# EAGLE design reciever_pcb (EAGLE 7.3.0)
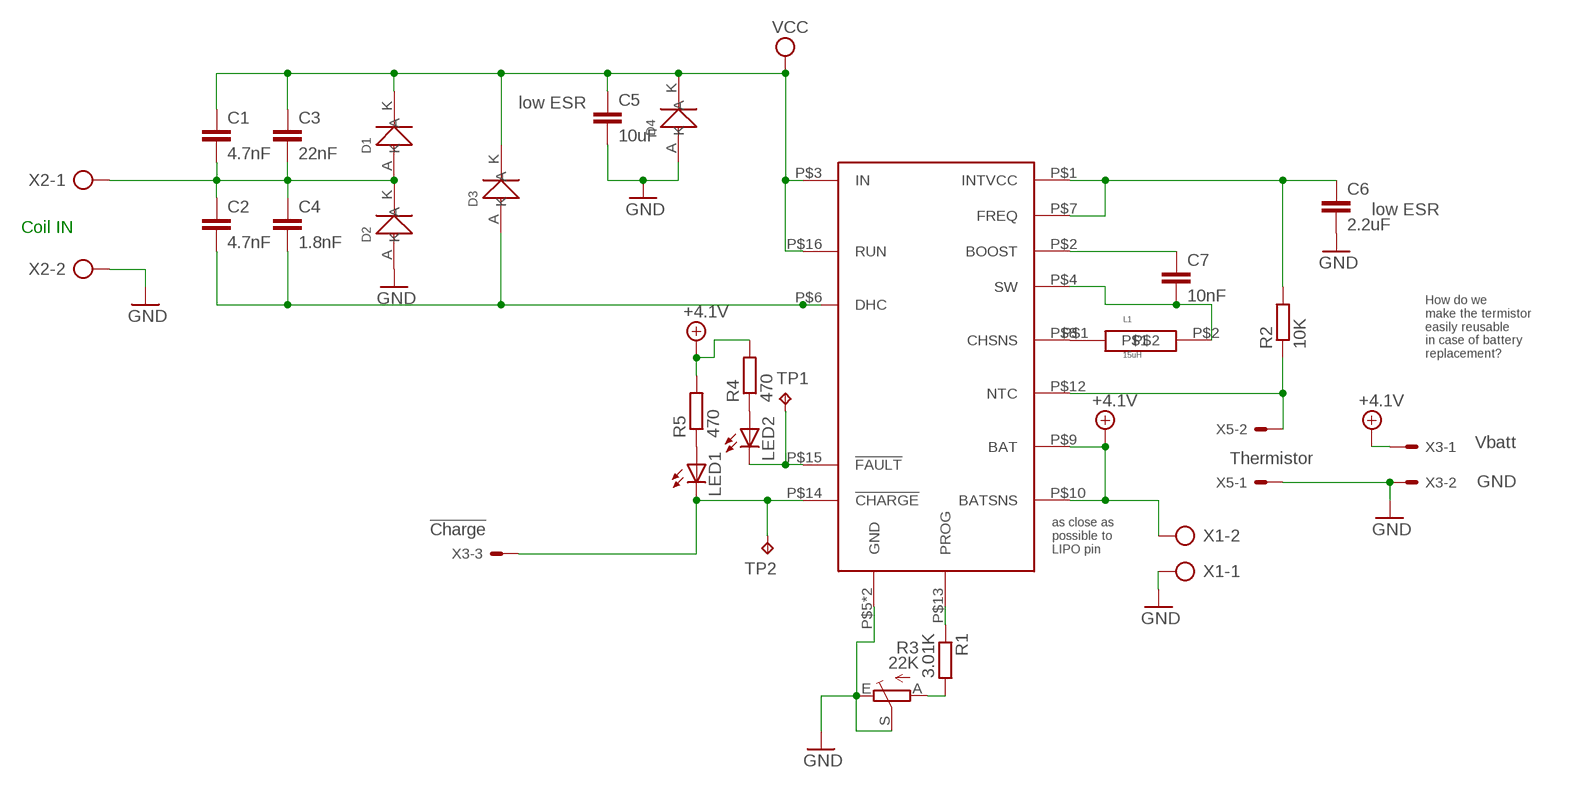
[diagram p0: schematic, sheet 1]

## Parts
C1  4.7nF  C-EUC0805  [C0805]
C2  4.7nF  C-EUC0805  [C0805]
C3  22nF  C-EUC0805  [C0805]
C4  1.8nF  C-EUC0805  [C0805]
C5  10uF  C-EUC0805  [C0805]
C6  2.2uF  C-EUC0805  [C0805]
C7  10nF  C-EUC0805  [C0805]
D1  DFLS240L  [POWERDI123]
D2  DFLS240L  [POWERDI123]
D3  DFLS240L  [POWERDI123]
D4  39VZ  DFLS240L  [POWERDI123]
L1  15uH  D62LCB  [D62LCB]
LED1  LEDCHIP-LED0805  [CHIP-LED0805]
LED2  LEDCHIP-LED0805  [CHIP-LED0805]
R1  3.01K  R-EU_R0805  [R0805]
R2  10K  R-EU_R0805  [R0805]
R3  22K  TRIM_EU-S63S  [S63S]
R4  470  R-EU_R0805  [R0805]
R5  470  R-EU_R0805  [R0805]
TP1  TPTP19R  [TP19R]
TP2  TPTP19R  [TP19R]
U$1  LT4120  [QFN16]
X1  AK500/2  [AK500/2]
X2  AK500/2  [AK500/2]
X3  KK-156-3  [KK-156-3]
X5  KK-156-2  [KK-156-2]

## Nets
+4.1V: R4.2 R5.2 U$1.P$9(BAT) U$1.P$10(BATSNS) X1.2 X3.1
GND: C5.2 C6.2 D2.A D4.A R3.E R3.S U$1.P$5(GND) U$1.P$17(GND) X1.1 X2.2 X3.2 X5.1
N$1: C1.2 C2.1 C3.2 C4.1 D1.A D2.K X2.1
N$2: C2.2 C4.2 D3.A U$1.P$6(DHC)
N$3: C6.1 R2.2 U$1.P$1(INTVCC) U$1.P$7(FREQ)
N$4: C7.1 U$1.P$2(BOOST)
N$5: C7.2 L1.P$2 U$1.P$4(SW)
N$6: L1.P$1 U$1.P$8(CHSNS)
N$7: R1.1 U$1.P$13(PROG)
N$8: R2.1 U$1.P$12(NTC) X5.2
N$9: LED1.C TP2.TP U$1.P$14(!CHARGE) X3.3
N$10: LED2.A R4.1
N$11: LED1.A R5.1
N$12: R1.2 R3.A
N$13: LED2.C TP1.TP U$1.P$15(!FAULT)
VCC: C1.1 C3.1 C5.1 D1.K D3.K D4.K U$1.P$3(IN) U$1.P$16(RUN)

## Notes on the sheet
- low ESR
- low ESR
- Coil IN
- How do we
  make the termistor
  easily reusable
  in case of battery
  replacement?
- Vbatt
- Thermistor
- GND
- !Charge
- as close as 
  possible to
  LIPO pin

## Library data of the parts
C1-C7 = rcl:C-EU: CAPACITOR, European symbol
D1-D4 = custom parts:DFLS240L
L1 = custom parts:D62LCB
LED1 LED2 = led:LED: LED OSRAM: - CHIPLED LG R971, LG N971, LY N971, LG Q971, LY Q971, LO R971, LY R971 LH N974, LH R974 LS Q976, LO Q976, LY Q976 LO Q996 - Hyper CHIPLED LW Q18S LB Q993, LB Q99A, LB R99A - SideLED LS A670, LO A670, LY A670, LG A670, LP A670 LB A673, LV A673, LT A673, LW A673 LH A674 LY A675 LS A676, LA A676, LO A676, LY A676, LW A676 LS A679, LY A679, LG A679 - Hyper Micro SIDELED® LS Y876, LA Y876, LO Y876, LY Y876 LT Y87S - SmartLED LW L88C, LW L88S LB L89C, LB L89S, LG L890 LS L89K, LO L89K, LY L89K LS L896, LA L896, LO L896, LY L896 - TOPLED LS T670, LO T670, LY T670, LG T670, LP T670 LSG T670, LSP T670, LSY T670, LOP T670, LYG T670 LG T671, LOG T671, LSG T671 LB T673, LV T673, LT T673, LW T673 LH T674 LS T676, LA T676, LO T676, LY T676, LB T676, LH T676, LSB T676, LW T676 LB T67C, LV T67C, LT T67C, LS T67K, LO T67K, LY T67K, LW E67C LS E67B, LA E67B, LO E67B, LY E67B, LB E67C, LV E67C, LT E67C LW T67C LS T679, LY T679, LG T679 LS T770, LO T770, LY T770, LG T770, LP T770 LB T773, LV T773, LT T773, LW T773 LH T774 LS E675, LA E675, LY E675, LS T675 LS T776, LA T776, LO T776, LY T776, LB T776 LHGB T686 LT T68C, LB T68C - Hyper Mini TOPLED® LB M676 - Mini TOPLED Santana® LG M470 LS M47K, LO M47K, LY M47K Source: http://www.osram.convergy.de LUXEON: - LUMILED® LXK2-PW12-R00, LXK2-PW12-S00, LXK2-PW14-U00, LXK2-PW14-V00 LXK2-PM12-R00, LXK2-PM12-S00, LXK2-PM14-U00 LXK2-PE12-Q00, LXK2-PE12-R00, LXK2-PE12-S00, LXK2-PE14-T00, LXK2-PE14-U00 LXK2-PB12-K00, LXK2-PB12-L00, LXK2-PB12-M00, LXK2-PB14-N00, LXK2-PB14-P00, LXK2-PB14-Q00 LXK2-PR12-L00, LXK2-PR12-M00, LXK2-PR14-Q00, LXK2-PR14-R00 LXK2-PD12-Q00, LXK2-PD12-R00, LXK2-PD12-S00 LXK2-PH12-R00, LXK2-PH12-S00 LXK2-PL12-P00, LXK2-PL12-Q00, LXK2-PL12-R00 Source: www.luxeon.com KINGBRIGHT: KA-3528ASYC Source: www.kingbright.com
R1 R2 R4 R5 = rcl:R-EU_: RESISTOR, European symbol
R3 = pot:TRIM_EU-: POTENTIOMETER
TP1 TP2 = testpad:TP: Test pad
U$1 = custom parts:LT4120
X1 X2 = con-ptr500:AK500/2: CONNECTOR; OC_FARNELL: unknown; OC_NEWARK: unknown
X3 = con-molex:KK-156-3: KK 156 HEADER Source: http://www.molex.com/pdm_docs/sd/026604100_sd.pdf; OC_FARNELL: unknown; OC_NEWARK: unknown
X5 = con-molex:KK-156-2: KK 156 HEADER Source: http://www.molex.com/pdm_docs/sd/026604100_sd.pdf; OC_FARNELL: unknown; OC_NEWARK: unknown

## Board
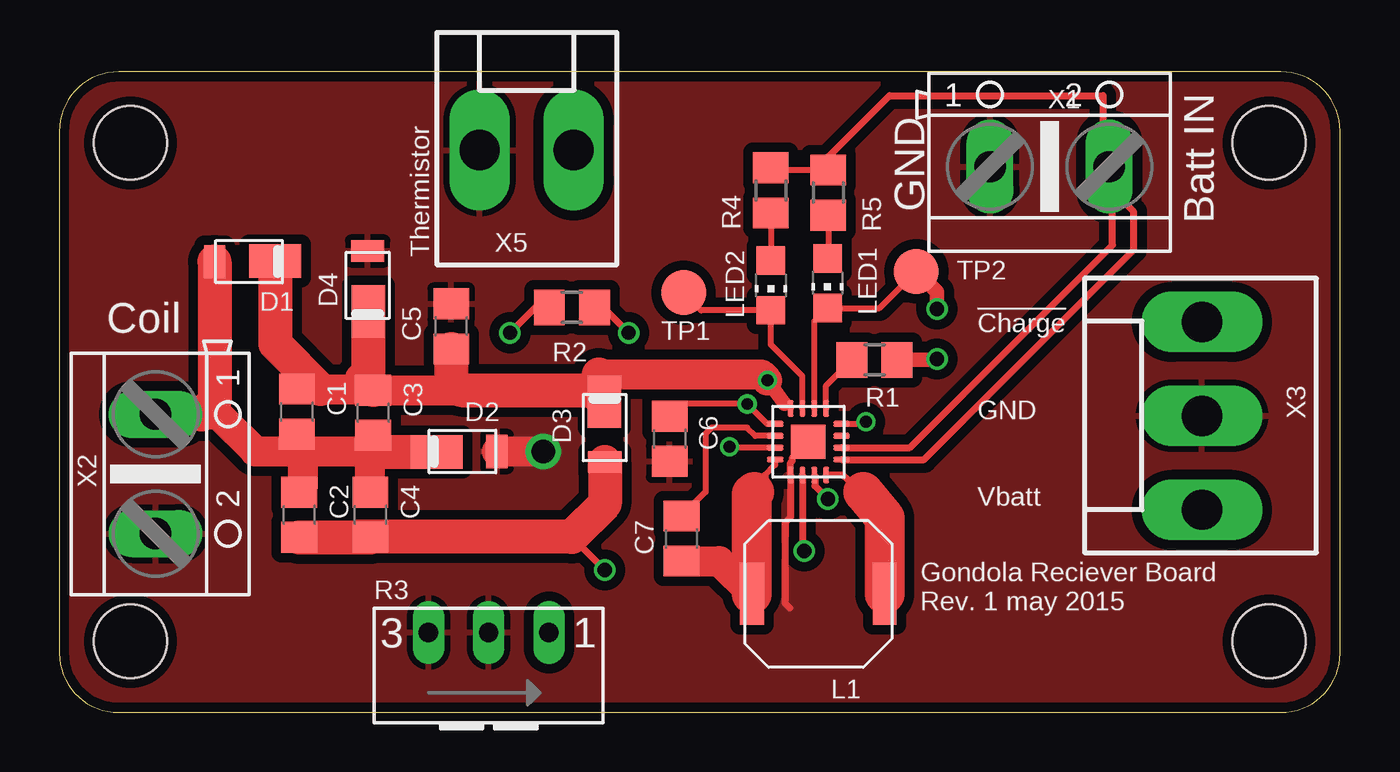
[diagram p1: board, top side]
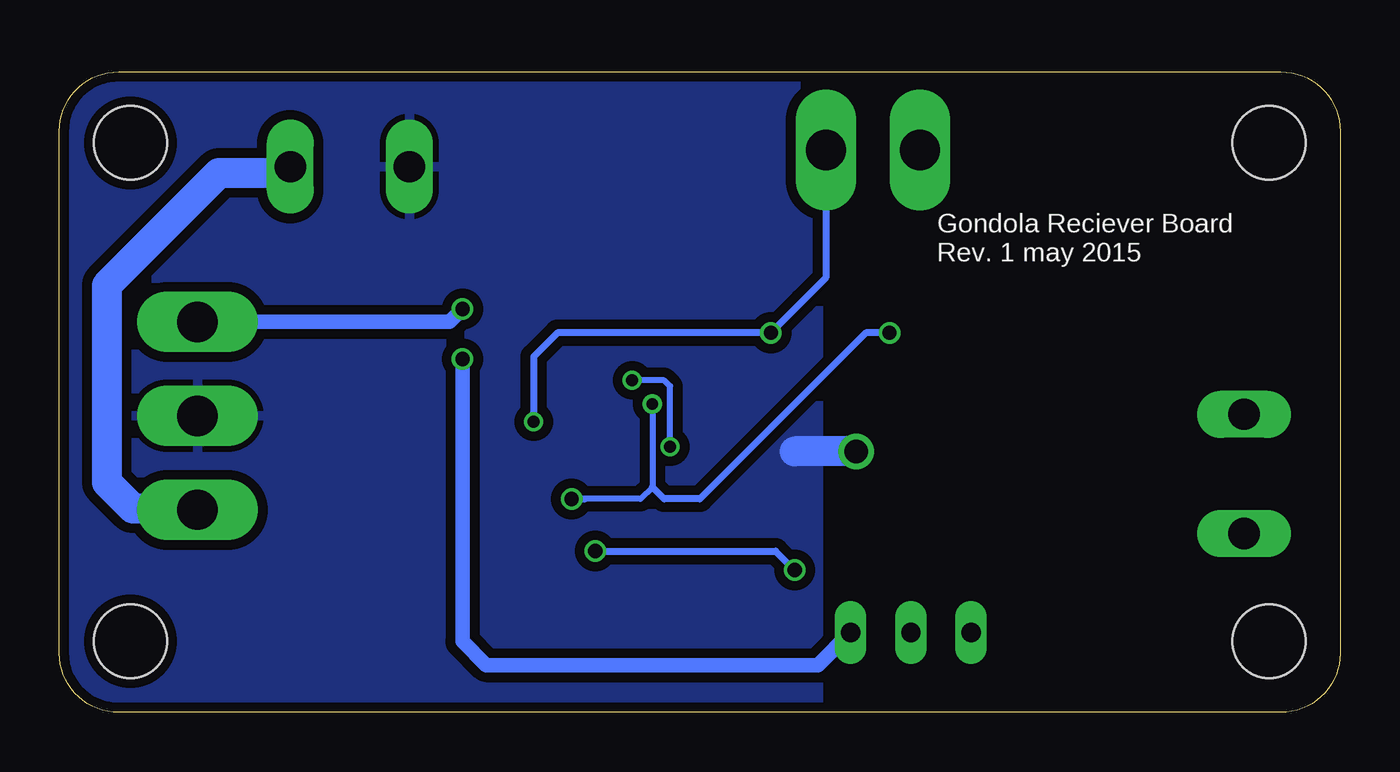
[diagram p2: board, bottom side, seen from below]

Size 54 x 27 mm. Coordinates in mm from the lower left corner, seen from the top.
Outline: 0,24.5 0,2.5 arc90 2.5,0 51.5,0 arc90 54,2.5 54,24.5 arc90 51.5,27 2.5,27 arc90 0,24.5
Copper layers (1*16): Top 0.035mm / dielectric 1.5mm / Bottom 0.035mm
Design rules "dirt_cheap_dirty_boards.v1": minimum track width 5mil, minimum drill 12mil, track to track 5mil, track to pad 5mil, pad to pad 5mil, via to via 5mil, smd to smd 0mil, copper to edge 10mil, drill to drill 10mil, minimum pad ring 10mil, minimum via ring 6mil, stop-mask expansion 2mil, vias tented up to drill 25mil, thermal gap 10mil
Holes 3.1 mm at 3,24 3,3 51,3 51,24

### Footprints (pad centres in the part's own frame; a part is rotated, then mirrored left to right if it is on the bottom)
C0805 = smd 1.3 x 1.5: 1 -0.95,0; 2 0.95,0
POWERDI123 = smd 0.9 x 1.4: A 1.45,0 | smd 2.2 x 1.4: K -1.1,-0.025
D62LCB = smd 1 x 2.6: P$1 -2.8,0; P$2 2.8,0
CHIP-LED0805 = smd 1.2 x 1.2: A 0,-1.05; C 0,1.05
R0805 = smd 1.3 x 1.5: 1 -0.95,0; 2 0.95,0
S63S = drill 0.813 long: A 2.54,1.27; E -2.54,1.27; S 0,1.27
TP19R = smd 1.9 x 1.9: TP 0,0
QFN16 = smd 0.7 x 0.25: P$1 -1.4,0.75; P$2 -1.4,0.25; P$3 -1.4,-0.25; P$4 -1.4,-0.75; P$9 1.4,-0.75; P$10 1.4,-0.25; P$11 1.4,0.25; P$12 1.4,0.75 | smd 0.25 x 0.7: P$5 -0.75,-1.4; P$6 -0.25,-1.4; P$7 0.25,-1.4; P$8 0.75,-1.4; P$13 0.75,1.4; P$14 0.25,1.4; P$15 -0.25,1.4; P$16 -0.75,1.4 | smd 1.45 x 1.45: P$17 0,0
AK500/2 = drill 1.321 long: 1 -2.515,0; 2 2.515,0
KK-156-3 = drill 1.7 pad 2.184 long: 1 -3.96,0; 2 0,0; 3 3.96,0
KK-156-2 = drill 1.7 pad 2.184 long: 1 -1.98,0; 2 1.98,0

### Placement (x,y rotation side)
C1  10.01,12.68 270 top
C2  10.11,8.33 270 top
C3  13.23,12.63 270 top
C4  13.11,8.33 270 top
C5  16.52,16.27 90 top
C6  25.73,11.53 270 top
C7  26.23,7.33 270 top
D1  8,19 180 top
D2  17,11 0 top
D3  23,12 270 top
D4  13,18 90 top
L1  32,5 180 top
LED1  32.39,18.09 180 top
LED2  30,18 180 top
R1  34.37,14.86 0 top
R2  21.61,17.07 180 top
R3  18.1,2.1 0 top
R4  30,22 90 top
R5  32.42,21.91 90 top
TP1  26.32,17.69 0 top
TP2  36.13,18.59 0 top
U$1  31.58,11.41 0 top
X1  41.75,23 0 top
X2  4.06,10.05 270 top
X3  48.17,12.5 90 top
X5  19.7,23.7 0 top

### Tracks (layer width: path | path; a pad name or v marks a point on that pad's centre or on a via)
+4.1V
  Top 0.254: R5.2 30.09,22.86 R4.2 | U$1.P$10 34.42,11.16 | U$1.P$9 35.66,10.66
  Top 0.305: U$1.P$10 35.86,11.16 44.4,19.7 44.4,22 | 44.4,22 44.4,22.86 X1.2 44,23.27 44,26 35,26 32.42,23.42 R5.2 | U$1.P$9 36.46,10.66 45.3,19.5 45.3,21.1 44.4,22
  Bottom 1.27: X3.1 47.23,8.6 50.9,8.6 52,9.7 52,18 47.27,22.73 44.53,22.73 X1.2
GND  (via drill 1)
  Top 0.305: U$1.P$17 30.9,10.73 30.9,10.6 30.83,10.53 U$1.P$5 30.83,8.23 30.6,8 30.6,4.6 30.8,4.4
  Top 1.27: D2.A v20.4,11
  Bottom 1.27: v20.4,11 23,11
  pour Top (isolate 0.406, rank 3): 0.25,0 30.25,0 54.25,0.25 54.25,27 0.25,27
  pour Bottom (isolate 0.406): 22,0 22,27 54,27 54,0
N$1
  Top 1.27: X2.1 6,12.56 6.68,12.56 8.25,11 10.25,11 | 10.25,11 13.25,11 | C4.1 13.11,10.86 13.25,11 | C3.2 13.23,11.02 13.25,11 | C1.2 10.01,11.24 10.25,11 | 10.25,11 10.25,9.42 C2.1
  Top 1.422: D1.A 6.55,13.12 6,12.56 | D2.K 13.28,10.97 13.25,11
N$2  (via drill 0.6)
  Top 0.305: U$1.P$6 31.33,6.87 v31.4,6.8 | v23,6 21.6,7.4
  Top 1.27: C2.2
  Top 1.422: C2.2 12.5,7.38 | 12.5,7.38 C4.2 | D3.A 23,8.8 21.6,7.4 12.52,7.4 12.5,7.38
  Bottom 0.305: v31.4,6.8 23.8,6.8 v23,6
N$3  (via drill 0.5, 0.6)
  Top 0.254: U$1.P$1 29.84,12.16 v29,13 26,13 C6.1 | 31.85,9.99 U$1.P$7
  Top 0.305: R2.2 20.46,17.46 v19,16 | 31.85,9.99 31.85,9.55 v32.4,9
  Bottom 0.254: v29,13 29,9.5 29.5,9 31.85,9
  Bottom 0.305: v19,16 20,16 27,9 28.5,9 29,9.5 | v32.4,9 31.85,9
N$4
  Top 0.254: U$1.P$2 29.34,11.66 29,12 27.5,12 27.25,11.75 27.25,9.3 C7.1
N$5
  Top 0.254: U$1.P$4 30.18,10.43 29.75,10
  Top 0.305: 29.75,10 29.75,9.75 29.3,9.3
  Top 1.27: C7.2 27.82,6.38 L1.P$2
  Top 1.676: L1.P$2 29.2,9.2 29.3,9.3
N$6
  Top 0.305: U$1.P$8 32.99,10.01 33.9,9.3
  Top 1.676: L1.P$1 34.8,8.2 33.9,9.3
N$7
  Top 0.254: U$1.P$13 32.33,13.77 R1.1
N$8  (via drill 0.5, 0.6)
  Top 0.254: U$1.P$12 33.91,12.16 v34,12.25
  Top 0.305: R2.1 22.36,17.64 v24,16
  Bottom 0.305: v24,16 33,16 34,15 v34,12.25 | 22.68,17.32 v24,16 | X5.2 21.68,18.32 v24,16
N$9  (via drill 0.6)
  Top 0.254: U$1.P$14 31.83,16.48 LED1.C 34.58,17.04 TP2.TP
  Top 0.61: v37,17 37,17.72 TP2.TP
  Bottom 0.61: X3.3 37.54,16.46 v37,17
N$10
  Top 0.254: R4.1 LED2.A
N$11
  Top 0.254: R5.1 32.42,19.17 LED1.A
N$12  (via drill 0.6)
  Top 0.61: R1.2 36.96,14.86 v37,14.9
  Bottom 0.61: v37,14.9 37,3 36,2 22.01,2 R3.A
N$13
  Top 0.254: U$1.P$15 31.33,14.17 30,15.5 LED2.C 27.06,16.95 TP1.TP
VCC  (via drill 0.5)
  Top 0.254: U$1.P$3 28.29,11.16 v28.25,11.2 | 30.85,12.83 U$1.P$16 30.58,13.02
  Top 0.61: 30.58,13.02 v29.85,14
  Top 1.27: C1.1 11,13.63 13.18,13.63 C3.1 16.94,13.58 | 22.75,14.25 29.6,14.25 v29.85,14
  Top 1.422: C3.1 12.76,14.05 13.03,14.31 D4.K | C5.1 16.52,14 16.94,13.58 22.33,13.58 22.75,14 | D1.K 9.1,15.53 11,13.63 | 22.75,14.25 22.75,14 | 22.75,14 22.75,13.32 D3.K
  Bottom 0.254: v28.25,11.2 28.25,13.75 28.5,14 v29.85,14

### Text on the board
tNames: Batt IN | GND | Thermistor | Coil | !Charge / / / GND / / / Vbatt | Gondola Reciever Board / Rev. 1 may 2015
bNames: Gondola Reciever Board / Rev. 1 may 2015